# Altium project Modulo Core MK1.PrjPcb (part 2 of 2)

## Sheet Beacons.SchDoc
size A4; SheetNumber: 7; SheetTotal: 7; SPICEModelCachePBGWWJEJ: <root> / <DocumentId>PBGWWJEJ</DocumentId> / <CacheFrame Number="0"> / <Model Name="0805_150080gs75000" Kind="CKT"> / <Text>****** / .subckt 0805_150080GS75000  1  2 / D1 1 2 SMCW / .MODEL SMCW D / + IS=906.98E-12 / + N=4.4982 / + RS=1.5743 / + IKF=518.93E-9 / + CJO=1.0000E-12 / + M=.3333 / + VJ=.75 / + BV=5 / + IBV=10.00E-6 / + TT=5.0000E-9 / .ends</Text> / </Model> / <Model Name="0603_885012206071_100nf" Kind="CKT"> / <Text>******* / .subckt 0603_885012206071_100nF 1 2 / Rser 1 3 0.025 / Lser 2 4 0.0000000008 / C1 3 4 0.0000001 / Rpar 3 4 5000000000 / .ends 0603_885012206071_100nF</Text> / </Model> / <Model Name="0805_150080ys75000" Kind="CKT"> / <Text>****** / .subckt 0805_150080YS75000  1  2 / D1 1 2 SMCW / .MODEL SMCW D / + IS=10.000E-21 / + N=1.8000 / + RS=1.0003E-6 / + IKF=1.8092E-3 / + CJO=1.0000E-12 / + M=.3333 / + VJ=.75 / + BV=5 / + IBV=10.00E-6 / + TT=5.0000E-9 / .ends</Text> / </Model> / </CacheFrame> / </root>
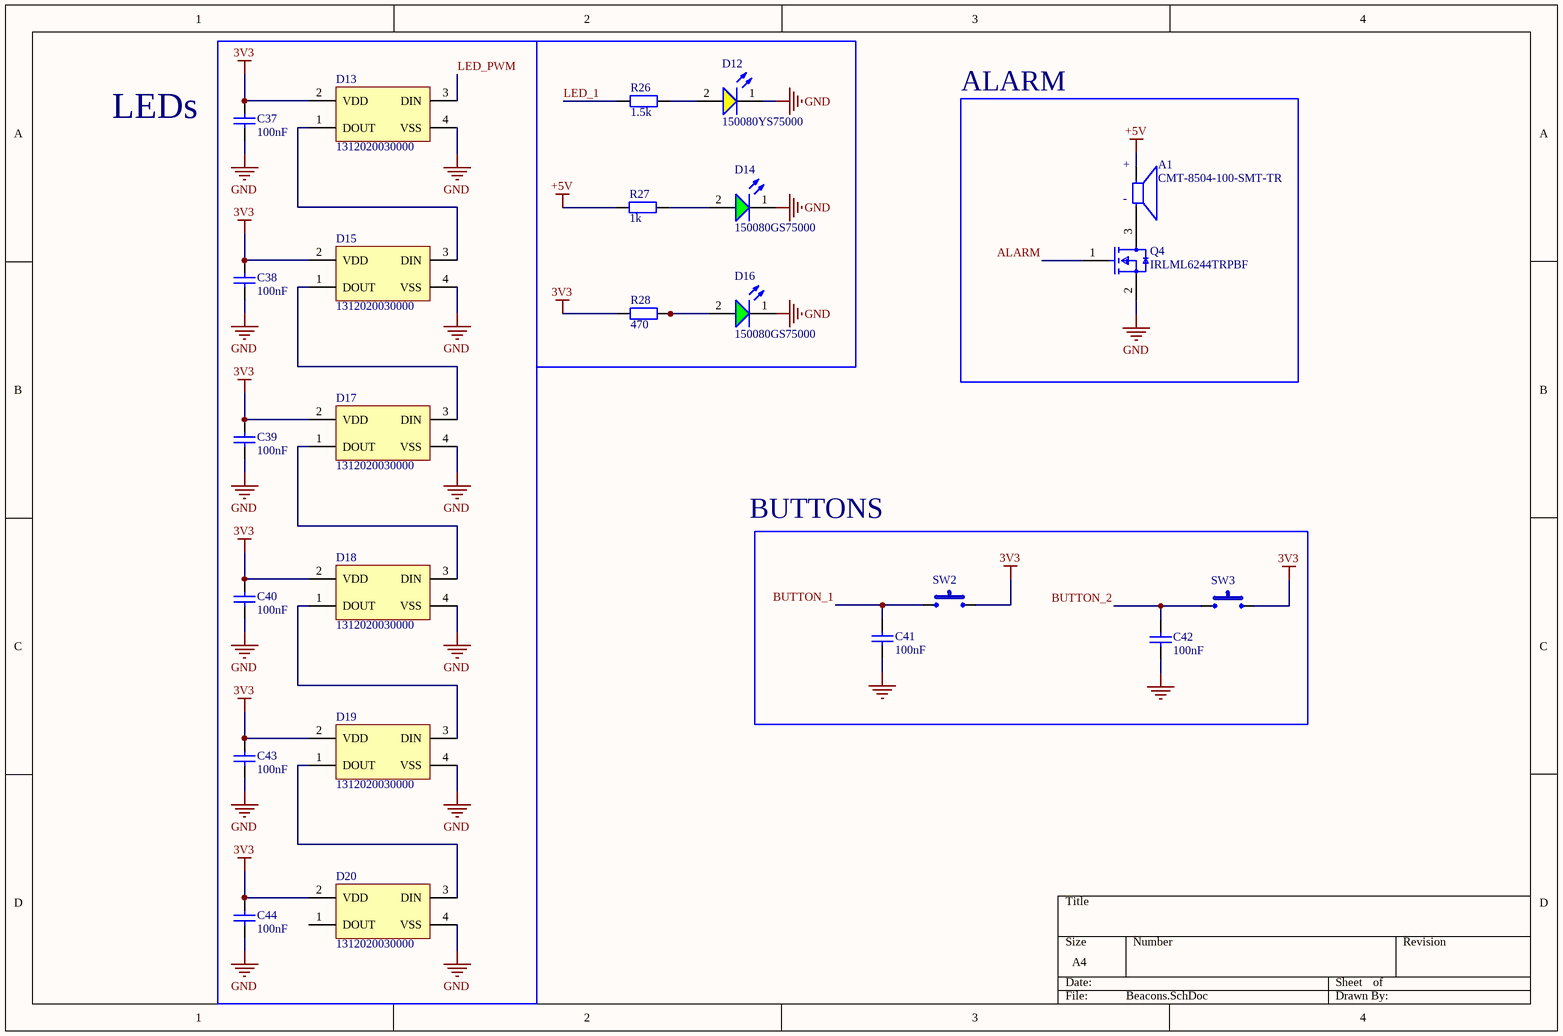
[diagram p7: Beacons.SchDoc]

### Parts
A1  CMT-8504-100-SMT-TR  [CMT-8504-100-SMT-TR-Footprint-1]
C37  value 100nF  [WCAP-CSGP_0603_L1.6W0.8H0.8_Reflow]  (hidden comment: 885012206071)
C38  value 100nF  [WCAP-CSGP_0603_L1.6W0.8H0.8_Reflow]  (hidden comment: 885012206071)
C39  value 100nF  [WCAP-CSGP_0603_L1.6W0.8H0.8_Reflow]  (hidden comment: 885012206071)
C40  value 100nF  [WCAP-CSGP_0603_L1.6W0.8H0.8_Reflow]  (hidden comment: 885012206071)
C41  value 100nF  [WCAP-CSGP_0603_L1.6W0.8H0.8_Reflow]  (hidden comment: 885012206071)
C42  value 100nF  [WCAP-CSGP_0603_L1.6W0.8H0.8_Reflow]  (hidden comment: 885012206071)
C43  value 100nF  [WCAP-CSGP_0603_L1.6W0.8H0.8_Reflow]  (hidden comment: 885012206071)
C44  value 100nF  [WCAP-CSGP_0603_L1.6W0.8H0.8_Reflow]  (hidden comment: 885012206071)
D12  150080YS75000  [WL-SMCW_0805_150080xx75000]
D13  1312020030000  [1312020030000]
D14  150080GS75000  [WL-SMCW_0805_150080xx75000]
D15  1312020030000  [1312020030000]
D16  150080GS75000  [WL-SMCW_0805_150080xx75000]
D17  1312020030000  [1312020030000]
D18  1312020030000  [1312020030000]
D19  1312020030000  [1312020030000]
D20  1312020030000  [1312020030000]
Q4  IRLML6244TRPBF  [FP-Micro3-IPC_C]
R26  value 1.5k  [WRIS-RSKS_0603_Reflow]  (hidden comment: 560112116038)
R27  value 1k  [WRIS-RSKS_0603_Reflow]  (hidden comment: 560112116014)
R28  value 470  [WRIS-RSKS_0603_Reflow]  (hidden comment: 560112116067)
SW2  PTS815SJM250SMTRLFS  [PTS815SJM250SMTRLFS-Footprint-1]  (value not drawn)
SW3  PTS815SJM250SMTRLFS  [PTS815SJM250SMTRLFS-Footprint-1]  (value not drawn)

### Blocks framed on the sheet
ALARM: A1 Q4

### Nets
3V3: C37.2 C38.2 C39.2 C40.2 C43.2 C44.2 D13.2(VDD) D15.2(VDD) D17.2(VDD) D18.2(VDD) D19.2(VDD) D20.2(VDD) R28.2 SW2.2 SW3.2  [project net 3V3_Current-]
+5V: A1.P R27.1  [project net 5V_Current-]
GND: C37.1 C38.1 C39.1 C40.1 C41.1 C42.1 C43.1 C44.1 D12.1(K) D13.4(VSS) D14.1(K) D15.4(VSS) D16.1(K) D17.4(VSS) D18.4(VSS) D19.4(VSS) D20.4(VSS) Q4.2(S)
ALARM: Q4.1(G)
BUTTON_1: C41.2 SW2.1
BUTTON_2: C42.2 SW3.1
LED_1: R26.1
LED_PWM: D13.3(DIN)
NetA1_N: A1.N Q4.3(D)
NetD12_2: D12.2(A) R26.2
NetD13_1: D13.1(DOUT) D15.3(DIN)
NetD14_2: D14.2(A) R27.2
NetD15_1: D15.1(DOUT) D17.3(DIN)
NetD16_2: D16.2(A) R28.1
NetD17_1: D17.1(DOUT) D18.3(DIN)
NetD18_1: D18.1(DOUT) D19.3(DIN)
NetD19_1: D19.1(DOUT) D20.3(DIN)

Not connected (* = marked no-connect by the designer): D20 1(DOUT)

### Notes on the sheet
- LEDs
- BUTTONS
- (in symbol CMP-00027-00000-2) +; -

### Library data of the parts
A1 = CMP-00027-00000-2: Alarm
C37-C44 = CMP-001-00661-1: WCAP-CSGP Multilayer Ceramic Chip Capacitor, General Purpose, size 0603, X7R, 100nF, 25VDC; Manufacturer: Wurth Elektronik; Dissipation Factor: 3.5%; Capacitance Tolerance: +/-10%; Insulation Resistance: 5GOhm; Technical Reference: X7R0603104K025DFCT10000; Rated Voltage (DC): 25V; Packaging: Tape and Reel; Height: 0.8mm; Mount: Surface Mount; Source: WCAP-CSGP.SchLib; Component Type: Standard; Category: Multilayer Ceramic Chip Capacitors; Operating Temperature Min: -55°C; Case/Package: 0603; ComponentLink2Description: Datasheet Link; Width: 0.8mm; ComponentLink1URL: https://www.we-online.com/redexpert/article/885012206071?ad; Length: 1.6mm; Operating Temperature Max: 125°C; Match Code: WCAP-CSGP; ComponentLink2URL: https://www.we-online.com/redexpert/spec/885012206071?ad; Design Item ID: 885012206071; ComponentLink1Description: Website Link; Manufacturer Part Number: 885012206071; Pins: 2; Ceramic Type: X7R
D12 = CMP-004-00456-1: WL-SMCW Mono-color Chip LED Waterclear, SMT, size 0805, Yellow, 2V, 140°; Manufacturer: Wurth Elektronik; Chip Technology: AlInGaP; Peak Wavelength: 595nm; Luminous Intensity: 120mcd; Dominant Wavelength: 590nm; ComponentLink1URL: https://www.we-online.com/redexpert/article/150080YS75000?ad; Match Code: WL-SMCW; Design Item ID: 150080YS75000; ComponentLink2Description: Datasheet Link; Mount: Surface Mount; Emitting Color: Yellow; Pins: 2; Case/Package: 0805; Viewing Angle: 140°; Packaging: Tape and Reel; Width: 1.25mm; ComponentLink2URL: https://www.we-online.com/redexpert/spec/150080YS75000?ad; Length: 2mm; Forward Voltage: 2V; Source: WL-SMCW.SchLib; Operating Temperature Max: 85°C; Manufacturer Part Number: 150080YS75000; Component Type: Standard; Operating Temperature Min: -40°C; ComponentLink1Description: Website Link; Category: Signal LEDs; Height: 0.7mm
D13 D15 D17-D20 = CMP-004-00010-1: WL-ICLED Integrated Controller within LED, Chip LED 2020, 5.5mA; Manufacturer: Wurth Elektronik; Viewing Angle: 120°; Dominant Wavelength (Blue): 470nm; Luminous Intensity (Red): 80mcd; Peak Wavelength (Blue): 465nm; Luminous Intensity (Blue): 50mcd; Peak Wavelength (Red): 630nm; Peak Wavelength (Green): 520nm; Emitting Color: Green & Red & Blue; Frequency of the PWM: 5kHz; Luminous Intensity (Green): 120mcd; Dominant Wavelength (Red): 625nm; Dominant Wavelength (Green): 525nm; Operating Temperature Min: -40°C; Category: IC LEDs; Match Code: WL-ICLED; ComponentLink1URL: https://www.we-online.com/redexpert/article/1312020030000?ad; Design Item ID: 1312020030000; Width: 2mm; IC Output Current: 5.5mA; Case/Package: Chip LED 2020; Packaging: Tape and Reel; Source: WL-ICLED.SchLib; Pins: 4; Operating Temperature Max: 85°C; ComponentLink1Description: Website Link; Length: 2mm; ComponentLink2Description: Datasheet Link; Manufacturer Part Number: 1312020030000; Component Type: Standard; Height: 0.9mm; Mount: Surface Mount; ComponentLink2URL: https://www.we-online.com/redexpert/spec/1312020030000?ad
D14 = CMP-004-00452-1: WL-SMCW Mono-color Chip LED Waterclear, SMT, size 0805, Green, 3.2V, 140°; Manufacturer: Wurth Elektronik; Dominant Wavelength: 525nm; Chip Technology: InGaN; Luminous Intensity: 450mcd; Peak Wavelength: 515nm; Viewing Angle: 140°; Source: WL-SMCW.SchLib; Category: Signal LEDs; Design Item ID: 150080GS75000; ComponentLink1URL: https://www.we-online.com/redexpert/article/150080GS75000?ad; Pins: 2; Emitting Color: Green; Mount: Surface Mount; ComponentLink2URL: https://www.we-online.com/redexpert/spec/150080GS75000?ad; Match Code: WL-SMCW; ComponentLink1Description: Website Link; Operating Temperature Max: 85°C; Case/Package: 0805; Manufacturer Part Number: 150080GS75000; Forward Voltage: 3.2V; Operating Temperature Min: -40°C; Component Type: Standard; Height: 0.7mm; Length: 2mm; Width: 1.25mm; Packaging: Tape and Reel; ComponentLink2Description: Datasheet Link
D16 = CMP-1426-00007-3: WURTH ELEKTRONIK - 150080GS75000 - LED, Green, SMD, 0805, 30 mA, 3.2 V, 520 nm; Forward Voltage: 3.2V; Viewing Angle: 140°; Power Dissipation: 105mW; Peak Wavelength: 515nm; Max Reverse Voltage (DC): 5V; Luminous Intensity: 450mcd; Wavelength: 525nm; Max Junction Temperature (Tj): 95°C; Forward Current: 100mA; Test Current: 20mA; Lens Style: Clear, Rectangular; Length: 2mm; Case/Package: 0805; Case Code (Metric): 2012; Color: Green; Height: 700µm; Width: 1.25mm; Packaging: Tape and Reel; Mount: Surface Mount; REACH SVHC: Unknown; RoHS: Compliant; Min Operating Temperature: -40°C; Reverse Voltage: 5V; Max Operating Temperature: 85°C; Dominant Wavelength: 525nm; Case Code (Imperial): 0805
Q4 = CMP-013-00010-1: Power Field-Effect Transistor, 6.3A I(D), 20V, 0.021ohm, 1-Element, N-Channel, Silicon, Metal-oxide Semiconductor FET, TO-236AB; RoHS Compliant: Yes; Max Operating Temperature: 150°C; Pins: 3
R26 = CMP-009-00361-1: WRIS-RSKS Thick Film Resistor, size 0603, 1500Ohm, 100mW; Manufacturer: Wurth Elektronik; Temperature Coefficient of Resistance Max: 100ppm/°C; Temperature Coefficient of Resistance Min: -100ppm/°C; Limiting Element Voltage: 75V; Resistance Tolerance: +/-1%; Component Type: Standard; Pins: 2; Packaging: Tape and Reel; Design Item ID: 560112116038; Case/Package: 0603; Operating Temperature Max: 155°C; Length: 1.6mm; ComponentLink2URL: https://www.we-online.com/redexpert/spec/560112116038?ad; ComponentLink1Description: Website Link; Operating Temperature Min: -55°C; Source: WRIS-RSKS.SchLib; Height: 0.45mm; Rated Power: 100mW; Match Code: WRIS-RSKS; Mount: Surface Mount; Category: Thick Film Resistors; Manufacturer Part Number: 560112116038; ComponentLink1URL: https://www.we-online.com/redexpert/article/560112116038?ad; Width: 0.8mm; ComponentLink2Description: Datasheet Link
R27 = CMP-009-00337-1: WRIS-RSKS Thick Film Resistor, size 0603, 1000Ohm, 100mW; Manufacturer: Wurth Elektronik; Resistance Tolerance: +/-1%; Limiting Element Voltage: 75V; Temperature Coefficient of Resistance Min: -100ppm/°C; Temperature Coefficient of Resistance Max: 100ppm/°C; Mount: Surface Mount; Rated Power: 100mW; Packaging: Tape and Reel; Case/Package: 0603; ComponentLink1URL: https://www.we-online.com/redexpert/article/560112116014?ad; Height: 0.45mm; Manufacturer Part Number: 560112116014; ComponentLink1Description: Website Link; ComponentLink2URL: https://www.we-online.com/redexpert/spec/560112116014?ad; Source: WRIS-RSKS.SchLib; Operating Temperature Min: -55°C; Width: 0.8mm; Match Code: WRIS-RSKS; Design Item ID: 560112116014; ComponentLink2Description: Datasheet Link; Category: Thick Film Resistors; Operating Temperature Max: 155°C; Component Type: Standard; Length: 1.6mm; Pins: 2
R28 = CMP-009-00390-1: WRIS-RSKS Thick Film Resistor, size 0603, 470Ohm, 100mW; Manufacturer: Wurth Elektronik; Limiting Element Voltage: 75V; Temperature Coefficient of Resistance Max: 100ppm/°C; Resistance Tolerance: +/-1%; Temperature Coefficient of Resistance Min: -100ppm/°C; Rated Power: 100mW; Height: 0.45mm; ComponentLink2Description: Datasheet Link; Component Type: Standard; ComponentLink1URL: https://www.we-online.com/redexpert/article/560112116067?ad; ComponentLink1Description: Website Link; Operating Temperature Min: -55°C; Match Code: WRIS-RSKS; Mount: Surface Mount; Case/Package: 0603; Source: WRIS-RSKS.SchLib; Length: 1.6mm; Category: Thick Film Resistors; Operating Temperature Max: 155°C; Pins: 2; Packaging: Tape and Reel; Manufacturer Part Number: 560112116067; ComponentLink2URL: https://www.we-online.com/redexpert/spec/560112116067?ad; Width: 0.8mm; Design Item ID: 560112116067
SW2 SW3 = CMP-011-00002-1: Keypad Switch, 1 Switches, SPST, Momentary-tactile, 0.05A, 12VDC, 2.26N, Solder Terminal, Surface Mount-straight

## Nets that join several sheets
3V3_Current+: Connectors (5 pins), Sensing (R5.2 U1.3)
3V3_Current-: MCU (12 pins), MCU_PWR (12 pins), Sensing (R3.2 R5.1 U1.4), Comms (6 pins), Storage (12 pins), Beacons (15 pins)
5V_Current+: Connectors (5 pins), Sensing (R4.2 U2.3), Comms (D9.5 J1.A4/B9 J1.A9/B4)
5V_Current-: Connectors (6 pins), Sensing (7 pins), Comms (C30.1 C33.1 Q2.3 Q3.3), Storage (C35.2 C36.2 IC1.8 IC2.8), Beacons (A1.P R27.1)
GND: MCU (15 pins), MCU_PWR (24 pins), Connectors (11 pins), Sensing (10 pins), Comms (15 pins), Storage (16 pins), Beacons (18 pins)
VBAT: MCU (B1.6), MCU_PWR (C23.1 C24.1)
VCAP1: MCU (B1.71), MCU_PWR (C19.2)
VCAP2: MCU (B1.106), MCU_PWR (C20.2)
VDD33USB: MCU (B1.95), MCU_PWR (C21.1 C22.1)
VDDA: MCU (B1.33), MCU_PWR (C17.1 C18.1)
VREF+: MCU (B1.32), MCU_PWR (C15.1 C16.1)
3V3_V_Sensing: MCU (B1.49), Sensing (R3.1 R7.2)
3V_ASensing: MCU (B1.60), Sensing (C28.2 R8.2)
5V_ASensing: MCU (B1.46), Sensing (C29.2 R9.2)
5V_V_Sensing: MCU (B1.47), Sensing (R2.1 R6.2)
ALARM: MCU (B1.3), Beacons (Q4.1)
BUTTON_1: MCU (B1.89), Beacons (C41.2 SW2.1)
BUTTON_2: MCU (B1.88), Beacons (C42.2 SW3.1)
CAM1_RX: MCU (B1.141), Connectors (D1.4)
CAM1_TX: MCU (B1.142), Connectors (D1.6)
CAM2_RX: MCU (B1.85), Connectors (D3.4)
CAM2_TX: MCU (B1.86), Connectors (D3.6)
CAM3_RX: MCU (B1.73), Connectors (D5.4)
CAM3_TX: MCU (B1.74), Connectors (D5.6)
CAM_ON: MCU (B1.36), Connectors (Q1.1)
CAN1_N: Connectors (D4.6), Comms (Q2.6 R12.1)
CAN1_P: Connectors (D4.4), Comms (Q2.7 R12.2)
CAN2_N: Connectors (D6.6), Comms (Q3.6 R13.1)
CAN2_P: Connectors (D6.4), Comms (Q3.7 R13.2)
CAN_1_STB: MCU (B1.118), Comms (Q2.8)
CAN_2_STB: MCU (B1.117), Comms (Q3.8)
FDCAN1_RX: MCU (B1.139), Comms (Q2.4)
FDCAN1_TX: MCU (B1.140), Comms (Q2.1)
FDCAN2_RX: MCU (B1.135), Comms (Q3.4)
FDCAN2_TX: MCU (B1.136), Comms (Q3.1)
LED_1: MCU (B1.80), Beacons (R26.1)
LED_PWM: MCU (B1.81), Beacons (D13.3)
RESET: MCU (B1.25), MCU_PWR (C25.2 SW1.1)
SD1_CD: MCU (B1.97), Storage (D10.3 J2.9)
SD1_CLK: MCU (B1.113), Storage (D10.6 J2.5)
SD1_CMD: MCU (B1.116), Storage (D10.8 J2.3 R16.2)
SD1_DATA0: MCU (B1.98), Storage (D10.5 J2.7 R22.2)
SD1_DATA1: MCU (B1.99), Storage (D10.4 J2.8 R23.2)
SD1_DATA2: MCU (B1.111), Storage (D10.2 J2.1 R18.2)
SD1_DATA3: MCU (B1.112), Storage (D10.1 J2.2 R17.2)
SD2_CD: MCU (B1.100), Storage (D11.3 J3.9)
SD2_CLK: MCU (B1.122), Storage (D11.6 J3.5)
SD2_CMD: MCU (B1.123), Storage (D11.8 J3.3 R19.2)
SD2_DATA0: MCU (B1.124), Storage (D11.5 J3.7 R24.2)
SD2_DATA1: MCU (B1.125), Storage (D11.4 J3.8 R25.2)
SD2_DATA2: MCU (B1.126), Storage (D11.2 J3.1 R20.2)
SD2_DATA3: MCU (B1.134), Storage (D11.1 J3.2 R21.2)
SPI_FLASH_1_NCS: MCU (B1.127), Storage (IC1.1)
SPI_FLASH_2_NCS: MCU (B1.64), Storage (IC2.1)
SPI_FLASH_CLK: MCU (B1.14), Storage (IC1.6 IC2.6)
SPI_FLASH_Q0: MCU (B1.10), Storage (IC1.5 IC2.5)
SPI_FLASH_Q1: MCU (B1.11), Storage (IC1.2 IC2.2)
SPI_FLASH_Q2: MCU (B1.12), Storage (IC1.3 IC2.3)
SPI_FLASH_Q3: MCU (B1.13), Storage (IC1.7 IC2.7)
SWCLK: MCU (B1.109), Connectors (D2.3)
SWDIO: MCU (B1.105), Connectors (D2.1)
THYONE_CTS: MCU (B1.21), Comms (MOD1.15)
THYONE_RTS: MCU (B1.20), Comms (MOD1.16)
THYONE_RX: MCU (B1.18), Comms (MOD1.13)
THYONE_TX: MCU (B1.19), Comms (MOD1.14)
USB_N: MCU (B1.103), Comms (D9.6)
USB_P: MCU (B1.104), Comms (D9.4)